# Altium schematic sheet Main.SchDoc
size A2 portrait
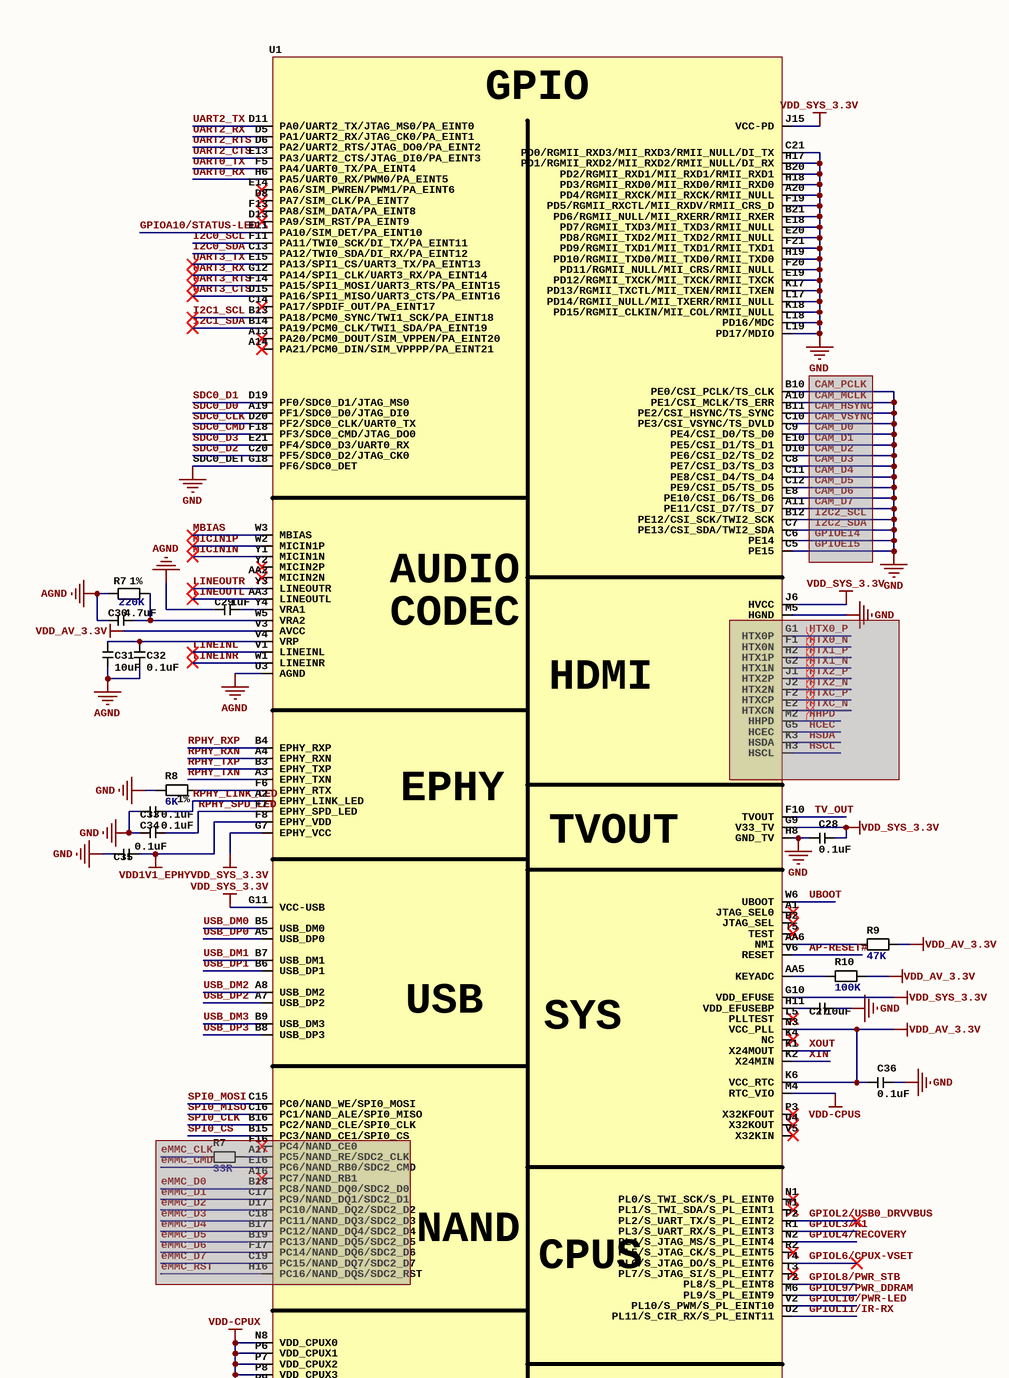
[diagram p0: Main.SchDoc, top left]
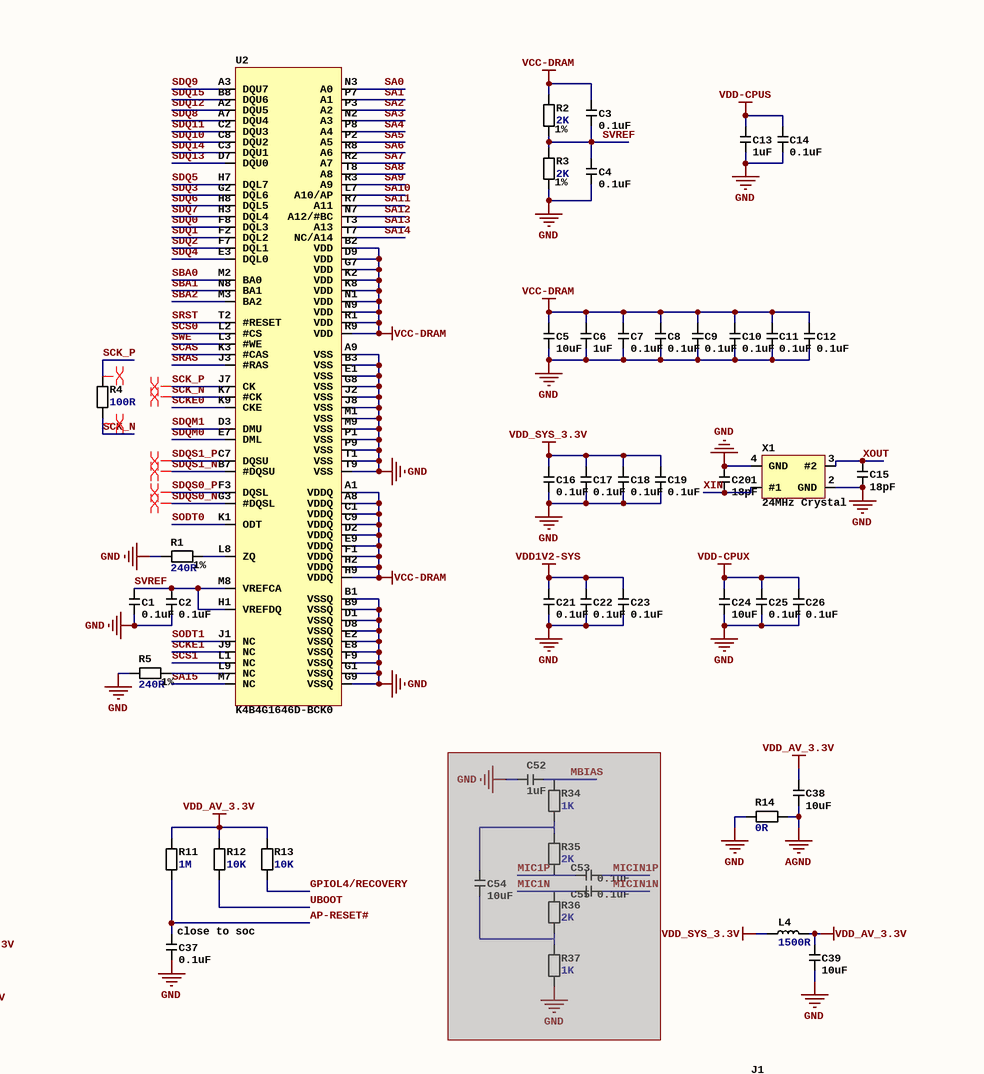
[diagram p1: Main.SchDoc, top right]
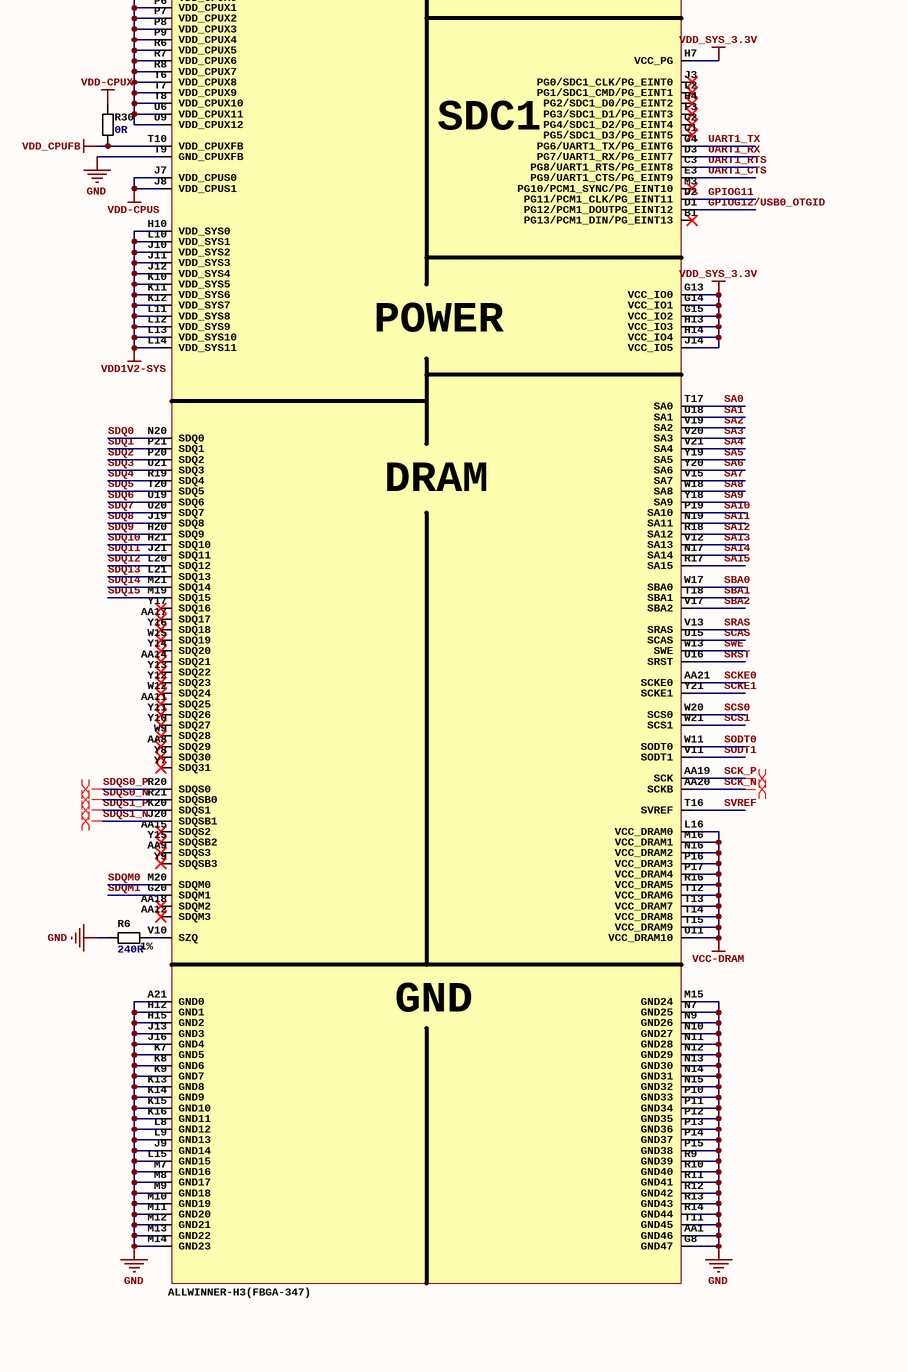
[diagram p2: Main.SchDoc, bottom left]
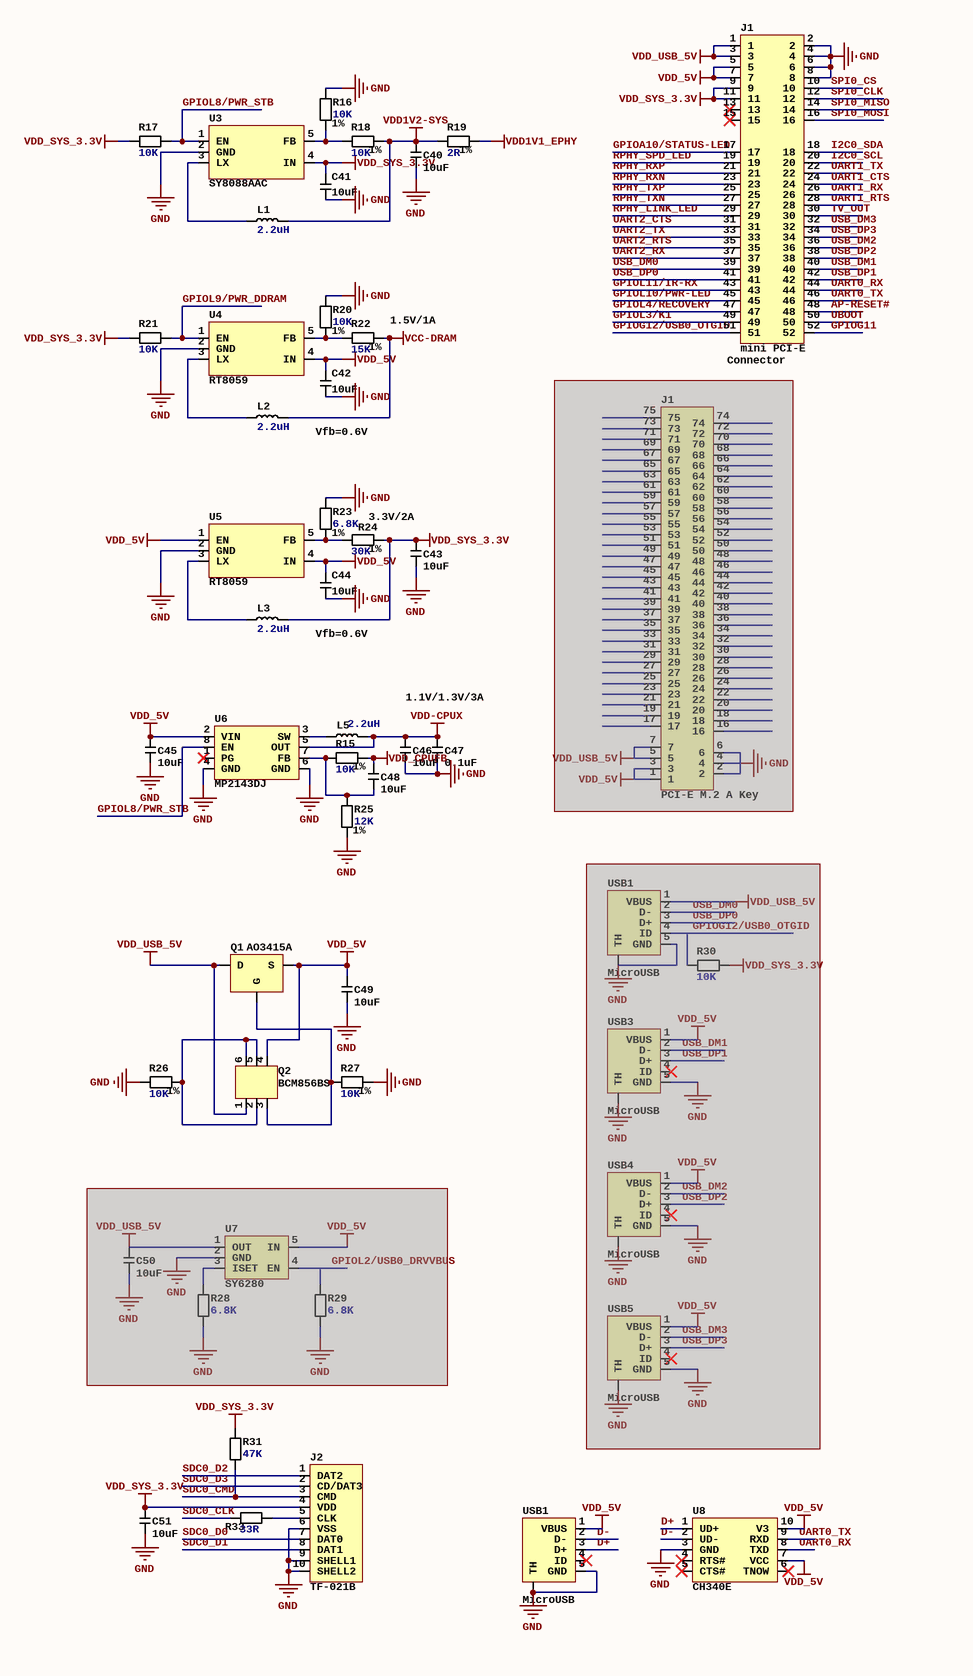
[diagram p3: Main.SchDoc, bottom right]

## Parts
(Parts that share a designator on the sheet are numbered #1, #2 ... from top to bottom, then left to right.)
C1  0.1uF  [CAP_0402]
C2  0.1uF  [CAP_0402]
C3  0.1uF  [CAP_0402]
C4  0.1uF  [CAP_0402]
C5  10uF  [CAP_0402]
C6  1uF  [CAP_0402]
C7  0.1uF  [CAP_0402]
C8  0.1uF  [CAP_0402]
C9  0.1uF  [CAP_0402]
C10  0.1uF  [CAP_0402]
C11  0.1uF  [CAP_0402]
C12  0.1uF  [CAP_0402]
C13  1uF  [CAP_0402]
C14  0.1uF  [CAP_0402]
C15  18pF  [CAP_0402]
C16  0.1uF  [CAP_0402]
C17  0.1uF  [CAP_0402]
C18  0.1uF  [CAP_0402]
C19  0.1uF  [CAP_0402]
C20  18pF  [CAP_0402]
C21  0.1uF  [CAP_0402]
C22  0.1uF  [CAP_0402]
C23  0.1uF  [CAP_0402]
C24  10uF  [CAP_0402]
C25  0.1uF  [CAP_0402]
C26  0.1uF  [CAP_0402]
C27  10uF  [CAP_0402]
C28  0.1uF  [CAP_0402]
C29  1uF  [CAP_0402]
C30  4.7uF  [CAP_0402]
C31  10uF  [CAP_0402]
C32  0.1uF  [CAP_0402]
C33  0.1uF  [CAP_0402]
C34  0.1uF  [CAP_0402]
C35  0.1uF  [CAP_0402]
C36  0.1uF  [CAP_0402]
C37  0.1uF  [CAP_0402]
C38  10uF  [CAP_0402]
C39  10uF  [CAP_0402]
C40  10uF  [CAP_0402]
C41  10uF  [CAP_0402]
C42  10uF  [CAP_0402]
C43  10uF  [CAP_0402]
C44  10uF  [CAP_0402]
C45  10uF  [CAP_0402]
C46  10uF  [CAP_0402]
C47  0.1uF  [CAP_0402]
C48  10uF  [CAP_0402]
C49  10uF  [CAP_0402]
C50  10uF  [CAP_0402]  (masked out: inside a compile mask, not in the netlist)
C51  10uF  [CAP_0402]
C52  1uF  [CAP_0402]  (masked out: inside a compile mask, not in the netlist)
C53  0.1uF  [CAP_0402]  (masked out: inside a compile mask, not in the netlist)
C54  10uF  [CAP_0402]  (masked out: inside a compile mask, not in the netlist)
C55  0.1uF  [CAP_0402]  (masked out: inside a compile mask, not in the netlist)
J1#1  mini PCI-E  System: Connector  [mini PCI-E]
J1#2  PCI-E M.2 A Key  [PCI-E M.2 A Key]  (masked out: inside a compile mask, not in the netlist)
J2  TF-021B  [TF-021B]
L1  2.2uH  [IND_2520]
L2  2.2uH  [IND_2520]
L3  2.2uH  [IND_2520]
L4  1500R  [IND_0402]
L5  2.2uH  [IND_2520]
Q1  AO3415A  [AO3415A]
Q2  BCM856BS  [BCM856BS]
R1  240R  [RES_0402]
R2  2K  [RES_0402]
R3  2K  [RES_0402]
R4  100R  [RES_0402]
R5  240R  [RES_0402]
R6  240R  [RES_0402]
R7#1  220K  [RES_0402]
R7#2  33R  [RES_0402]  (masked out: inside a compile mask, not in the netlist)
R8  6K  [RES_0402]
R9  47K  [RES_0402]
R10  100K  [RES_0402]
R11  1M  [RES_0402]
R12  10K  [RES_0402]
R13  10K  [RES_0402]
R14  0R  [RES_0402]
R15  10K  [RES_0402]
R16  10K  [RES_0402]
R17  10K  [RES_0402]
R18  10K  [RES_0402]
R19  2R  [RES_0402]
R20  10K  [RES_0402]
R21  10K  [RES_0402]
R22  15K  [RES_0402]
R23  6.8K  [RES_0402]
R24  30K  [RES_0402]
R25  12K  [RES_0402]
R26  10K  [RES_0402]
R27  10K  [RES_0402]
R28  6.8K  [RES_0402]  (masked out: inside a compile mask, not in the netlist)
R29  6.8K  [RES_0402]  (masked out: inside a compile mask, not in the netlist)
R30#1  0R  [RES_0402]
R30#2  10K  [RES_0402]  (masked out: inside a compile mask, not in the netlist)
R31  47K  [RES_0402]
R33  33R  [RES_0402]
R34  1K  [RES_0402]  (masked out: inside a compile mask, not in the netlist)
R35  2K  [RES_0402]  (masked out: inside a compile mask, not in the netlist)
R36  2K  [RES_0402]  (masked out: inside a compile mask, not in the netlist)
R37  1K  [RES_0402]  (masked out: inside a compile mask, not in the netlist)
U1  ALLWINNER-H3(FBGA-347)  [ALLWINNER-H3]
U2  K4B4G1646D-BCK0  [K4B4G1646D-BCK0]
U3  SY8088AAC  [SY8088AAC]
U4  RT8059  [RT8059]
U5  RT8059  [RT8059]
U6  MP2143DJ  [MP2143DJ]
U7  SY6280  [SY6280]  (masked out: inside a compile mask, not in the netlist)
U8  CH340E  [CH340E]
USB1#1  MicroUSB  [MicroUSB]  (masked out: inside a compile mask, not in the netlist)
USB1#2  MicroUSB  [MicroUSB]
USB3  MicroUSB  [MicroUSB]  (masked out: inside a compile mask, not in the netlist)
USB4  MicroUSB  [MicroUSB]  (masked out: inside a compile mask, not in the netlist)
USB5  MicroUSB  [MicroUSB]  (masked out: inside a compile mask, not in the netlist)
X1  24MHz Crystal  [SMD2520]

## Nets
AGND: C29.1 C30.1 C31.1 C32.1 C38.1 R7#1.2 R14.2 U1.U3(AGND)
GND: C1.1 C2.1 C4.1 C5.1 C6.1 C7.1 C8.1 C9.1 C10.1 C11.1 C12.1 C13.1 C14.1 C15.1 C16.1 C17.1 C18.1 C19.1 C20.2 C21.1 C22.1 C23.1 C24.1 C25.1 C26.1 C27.2 C28.1 C33.1 C34.1 C35.1 C36.2 C37.1 C39.1 C40.1 C41.1 C42.1 C43.1 C44.1 C45.1 C46.1 C47.1 C49.1 C51.1 J1#1.2 J1#1.4 J1#1.6 J1#1.8 J2.6(VSS) J2.9(SHELL1) J2.10(SHELL2) R1.1 R3.1 R5.1 R6.1 R8.1 R14.1 R16.2 R20.2 R23.2 R25.1 R26.1 R27.2 U1.A10(PE1/CSI_MCLK/TS_ERR) U1.A11(PE11/CSI_D7/TS_D7) U1.A20(PD4/RGMII_RXCK/MII_RXCK/RMII_NULL) U1.A21(GND0) U1.AA1(GND46) U1.B10(PE0/CSI_PCLK/TS_CLK) U1.B11(PE2/CSI_HSYNC/TS_SYNC) U1.B12(PE12/CSI_SCK/TWI2_SCK) U1.B20(PD2/RGMII_RXD1/MII_RXD1/RMII_RXD1) U1.B21(PD6/RGMII_NULL/MII_RXERR/RMII_RXER) U1.C5(PE15) U1.C6(PE14) U1.C7(PE13/CSI_SDA/TWI2_SDA) U1.C8(PE7/CSI_D3/TS_D3) U1.C9(PE4/CSI_D0/TS_D0) U1.C10(PE3/CSI_VSYNC/TS_DVLD) U1.C11(PE8/CSI_D4/TS_D4) U1.C12(PE9/CSI_D5/TS_D5) U1.C21(PD0/RGMII_RXD3/MII_RXD3/RMII_NULL/DI_TX) U1.D10(PE6/CSI_D2/TS_D2) U1.E8(PE10/CSI_D6/TS_D6) U1.E10(PE5/CSI_D1/TS_D1) U1.E18(PD7/RGMII_TXD3/MII_TXD3/RMII_NULL) U1.E19(PD12/RGMII_TXCK/MII_TXCK/RMII_TXCK) U1.E20(PD8/RGMII_TXD2/MII_TXD2/RMII_NULL) U1.F19(PD5/RGMII_RXCTL/MII_RXDV/RMII_CRS_D) U1.F20(PD11/RGMII_NULL/MII_CRS/RMII_NULL) U1.F21(PD9/RGMII_TXD1/MII_TXD1/RMII_TXD1) U1.G8(GND47) U1.G18(PF6/SDC0_DET) U1.H8(GND_TV) U1.H12(GND1) U1.H15(GND2) U1.H17(PD1/RGMII_RXD2/MII_RXD2/RMII_NULL/DI_RX) U1.H18(PD3/RGMII_RXD0/MII_RXD0/RMII_RXD0) U1.H19(PD10/RGMII_TXD0/MII_TXD0/RMII_TXD0) U1.J9(GND14) U1.J13(GND3) U1.J16(GND4) U1.K7(GND5) U1.K8(GND6) U1.K9(GND7) U1.K13(GND8) U1.K14(GND9) U1.K15(GND10) U1.K16(GND11) U1.K17(PD13/RGMII_TXCTL/MII_TXEN/RMII_TXEN) U1.K18(PD15/RGMII_CLKIN/MII_COL/RMII_NULL) U1.L8(GND12) U1.L9(GND13) U1.L15(GND15) U1.L17(PD14/RGMII_NULL/MII_TXERR/RMII_NULL) U1.L18(PD16/MDC) U1.L19(PD17/MDIO) U1.M5(HGND) U1.M7(GND16) U1.M8(GND17) U1.M9(GND18) U1.M10(GND19) U1.M11(GND20) U1.M12(GND21) U1.M13(GND22) U1.M14(GND23) U1.M15(GND24) U1.N7(GND25) U1.N9(GND26) U1.N10(GND27) U1.N11(GND28) U1.N12(GND29) U1.N13(GND30) U1.N14(GND31) U1.N15(GND32) U1.P10(GND33) U1.P11(GND34) U1.P12(GND35) U1.P13(GND36) U1.P14(GND37) U1.P15(GND38) U1.R9(GND39) U1.R10(GND40) U1.R11(GND41) U1.R12(GND42) U1.R13(GND43) U1.R14(GND44) U1.T9(GND_CPUXFB) U1.T11(GND45) U2.A9(VSS) U2.B1(VSSQ) U2.B3(VSS) U2.B9(VSSQ) U2.D1(VSSQ) U2.D8(VSSQ) U2.E1(VSS) U2.E2(VSSQ) U2.E8(VSSQ) U2.F9(VSSQ) U2.G1(VSSQ) U2.G8(VSS) U2.G9(VSSQ) U2.J2(VSS) U2.J8(VSS) U2.M1(VSS) U2.M9(VSS) U2.P1(VSS) U2.P9(VSS) U2.T1(VSS) U2.T9(VSS) U3.2(GND) U4.2(GND) U5.2(GND) U6.4(GND) U6.6(GND) U8.3(GND) USB1#2.0(TH) USB1#2.5(GND) X1.2(GND) X1.4(GND)
VCC-DRAM: C3.2 C5.2 C6.2 C7.2 C8.2 C9.2 C10.2 C11.2 C12.2 L2.2 R2.2 R22.2 U1.L16(VCC_DRAM0) U1.M16(VCC_DRAM1) U1.N16(VCC_DRAM2) U1.P16(VCC_DRAM3) U1.P17(VCC_DRAM4) U1.R16(VCC_DRAM5) U1.T12(VCC_DRAM6) U1.T13(VCC_DRAM7) U1.T14(VCC_DRAM8) U1.T15(VCC_DRAM9) U1.U11(VCC_DRAM10) U2.A1(VDDQ) U2.A8(VDDQ) U2.B2(VDD) U2.C1(VDDQ) U2.C9(VDDQ) U2.D2(VDDQ) U2.D9(VDD) U2.E9(VDDQ) U2.F1(VDDQ) U2.G7(VDD) U2.H2(VDDQ) U2.H9(VDDQ) U2.K2(VDD) U2.K8(VDD) U2.N1(VDD) U2.N9(VDD) U2.R1(VDD) U2.R9(VDD)
VDD1V1_EPHY: C35.2 R19.2 U1.F8(EPHY_VDD)
VDD1V2-SYS: C21.2 C22.2 C23.2 C40.2 L1.2 R18.2 R19.1 U1.H10(VDD_SYS0) U1.J10(VDD_SYS2) U1.J11(VDD_SYS3) U1.J12(VDD_SYS4) U1.K10(VDD_SYS5) U1.K11(VDD_SYS6) U1.K12(VDD_SYS7) U1.L10(VDD_SYS1) U1.L11(VDD_SYS8) U1.L12(VDD_SYS9) U1.L13(VDD_SYS10) U1.L14(VDD_SYS11)
VDD-CPUS: C13.2 C14.2 U1.J7(VDD_CPUS0) U1.J8(VDD_CPUS1) U1.M4(RTC_VIO)
VDD-CPUX: C24.2 C25.2 C26.2 C46.2 C47.2 L5.2 R30#1.2 U1.N8(VDD_CPUX0) U1.P6(VDD_CPUX1) U1.P7(VDD_CPUX2) U1.P8(VDD_CPUX3) U1.P9(VDD_CPUX4) U1.R6(VDD_CPUX5) U1.R7(VDD_CPUX6) U1.R8(VDD_CPUX7) U1.T6(VDD_CPUX8) U1.T7(VDD_CPUX9) U1.T8(VDD_CPUX10) U1.U6(VDD_CPUX11) U1.U9(VDD_CPUX12) U6.5(OUT)
VDD_5V: C42.2 C44.2 C45.2 C49.2 J1#1.5 J1#1.7 Q1.2(S) Q2.4 U4.4(IN) U5.1(EN) U5.4(IN) U6.2(VIN) U8.7(VCC) U8.10(V3) USB1#2.1(VBUS)
VDD_AV_3.3V: C36.1 C38.2 C39.2 L4.2 R9.2 R10.2 R11.2 R12.2 R13.2 U1.K6(VCC_RTC) U1.N3(VCC_PLL) U1.V3(AVCC)
VDD_CPUFB: C48.2 R15.2 R30#1.1 U1.T10(VDD_CPUXFB)
VDD_SYS_3.3V: C16.2 C17.2 C18.2 C19.2 C28.2 C41.2 C43.2 C51.2 J1#1.9 J1#1.11 J2.4(VDD) L3.2 L4.1 R17.1 R21.1 R24.2 R31.2 U1.G7(EPHY_VCC) U1.G9(V33_TV) U1.G10(VDD_EFUSE) U1.G11(VCC-USB) U1.G13(VCC_IO0) U1.G14(VCC_IO1) U1.G15(VCC_IO2) U1.H7(VCC_PG) U1.H13(VCC_IO3) U1.H14(VCC_IO4) U1.J6(HVCC) U1.J14(VCC_IO5) U1.J15(VCC-PD) U3.4(IN)
VDD_USB_5V: J1#1.1 J1#1.3 Q1.3(D) Q2.1
AP-RESET#: C37.2 J1#1.48 R11.1 U1.V6(RESET)
D+: U8.1(UD+) USB1#2.3(D+)
D-: U8.2(UD-) USB1#2.2(D-)
GPIOA10/STATUS-LED: J1#1.17 U1.E11(PA10/SIM_DET/PA_EINT10)
GPIOG11: J1#1.52 U1.D2(PG11/PCM1_CLK/PG_EINT11)
GPIOG12/USB0_OTGID: J1#1.51 U1.D1(PG12/PCM1_DOUTPG_EINT12)
GPIOL2/USB0_DRVVBUS: U1.P2(PL2/S_UART_TX/S_PL_EINT2)
GPIOL3/K1: J1#1.49 U1.R1(PL3/S_UART_RX/S_PL_EINT3)
GPIOL4/RECOVERY: J1#1.47 R13.1 U1.N2(PL4/S_JTAG_MS/S_PL_EINT4)
GPIOL6/CPUX-VSET: U1.T4(PL6/S_JTAG_DO/S_PL_EINT6)
GPIOL8/PWR_STB: R17.2 U1.T2(PL8/S_PL_EINT8) U3.1(EN) U6.8(EN)
GPIOL9/PWR_DDRAM: R21.2 U1.M6(PL9/S_PL_EINT9) U4.1(EN)
GPIOL10/PWR-LED: J1#1.45 U1.V2(PL10/S_PWM/S_PL_EINT10)
GPIOL11/IR-RX: J1#1.43 U1.U2(PL11/S_CIR_RX/S_PL_EINT11)
I2C0_SCL: J1#1.20 U1.F11(PA11/TWI0_SCK/DI_TX/PA_EINT11)
I2C0_SDA: J1#1.18 U1.C13(PA12/TWI0_SDA/DI_RX/PA_EINT12)
I2C1_SCL: U1.B13(PA18/PCM0_SYNC/TWI1_SCK/PA_EINT18)
I2C1_SDA: U1.B14(PA19/PCM0_CLK/TWI1_SDA/PA_EINT19)
LINEINL: U1.V1(LINEINL)
LINEINR: U1.W1(LINEINR)
LINEOUTL: U1.AA3(LINEOUTL)
LINEOUTR: U1.Y3(LINEOUTR)
MBIAS: U1.W3(MBIAS)
MICIN1N: U1.Y1(MICIN1N)
MICIN1P: U1.W2(MICIN1P)
RPHY_LINK_LED: C33.2 J1#1.29 U1.A2(EPHY_LINK_LED)
RPHY_RXN: J1#1.23 U1.A4(EPHY_RXN)
RPHY_RXP: J1#1.21 U1.B4(EPHY_RXP)
RPHY_SPD_LED: C34.2 J1#1.19 U1.F7(EPHY_SPD_LED)
RPHY_TXN: J1#1.27 U1.A3(EPHY_TXN)
RPHY_TXP: J1#1.25 U1.B3(EPHY_TXP)
SA0: U1.T17(SA0) U2.N3(A0)
SA1: U1.U18(SA1) U2.P7(A1)
SA2: U1.V19(SA2) U2.P3(A2)
SA3: U1.V20(SA3) U2.N2(A3)
SA4: U1.V21(SA4) U2.P8(A4)
SA5: U1.Y19(SA5) U2.P2(A5)
SA6: U1.Y20(SA6) U2.R8(A6)
SA7: U1.V15(SA7) U2.R2(A7)
SA8: U1.W18(SA8) U2.T8(A8)
SA9: U1.Y18(SA9) U2.R3(A9)
SA10: U1.P19(SA10) U2.L7(A10/AP)
SA11: U1.N19(SA11) U2.R7(A11)
SA12: U1.R18(SA12) U2.N7(A12/#BC)
SA13: U1.V12(SA13) U2.T3(A13)
SA14: U1.N17(SA14) U2.T7(NC/A14)
SA15: U1.R17(SA15) U2.M7(NC)
SBA0: U1.W17(SBA0) U2.M2(BA0)
SBA1: U1.T18(SBA1) U2.N8(BA1)
SBA2: U1.V17(SBA2) U2.M3(BA2)
SCAS: U1.U15(SCAS) U2.K3(#CAS)
SCK_N: R4.1 U1.AA20(SCKB) U2.K7(#CK)
SCK_P: R4.2 U1.AA19(SCK) U2.J7(CK)
SCKE0: U1.AA21(SCKE0) U2.K9(CKE)
SCKE1: U1.Y21(SCKE1) U2.J9(NC)
SCS0: U1.W20(SCS0) U2.L2(#CS)
SCS1: U1.W21(SCS1) U2.L1(NC)
SDC0_CLK: R33.1 U1.D20(PF2/SDC0_CLK/UART0_TX)
SDC0_CMD: J2.3(CMD) R31.1 U1.F18(PF3/SDC0_CMD/JTAG_DO0)
SDC0_D0: J2.7(DAT0) U1.A19(PF1/SDC0_D0/JTAG_DI0)
SDC0_D1: J2.8(DAT1) U1.D19(PF0/SDC0_D1/JTAG_MS0)
SDC0_D2: J2.1(DAT2) U1.C20(PF5/SDC0_D2/JTAG_CK0)
SDC0_D3: J2.2(CD/DAT3) U1.E21(PF4/SDC0_D3/UART0_RX)
SDQ0: U1.N20(SDQ0) U2.F8(DQL3)
SDQ1: U1.P21(SDQ1) U2.F2(DQL2)
SDQ2: U1.P20(SDQ2) U2.F7(DQL1)
SDQ3: U1.U21(SDQ3) U2.G2(DQL6)
SDQ4: U1.R19(SDQ4) U2.E3(DQL0)
SDQ5: U1.T20(SDQ5) U2.H7(DQL7)
SDQ6: U1.U19(SDQ6) U2.H8(DQL5)
SDQ7: U1.U20(SDQ7) U2.H3(DQL4)
SDQ8: U1.J19(SDQ8) U2.A7(DQU4)
SDQ9: U1.H20(SDQ9) U2.A3(DQU7)
SDQ10: U1.H21(SDQ10) U2.C8(DQU2)
SDQ11: U1.J21(SDQ11) U2.C2(DQU3)
SDQ12: U1.L20(SDQ12) U2.A2(DQU5)
SDQ13: U1.L21(SDQ13) U2.D7(DQU0)
SDQ14: U1.M21(SDQ14) U2.C3(DQU1)
SDQ15: U1.M19(SDQ15) U2.B8(DQU6)
SDQM0: U1.M20(SDQM0) U2.E7(DML)
SDQM1: U1.G20(SDQM1) U2.D3(DMU)
SDQS0_N: U1.R21(SDQSB0) U2.G3(#DQSL)
SDQS0_P: U1.R20(SDQS0) U2.F3(DQSL)
SDQS1_N: U1.J20(SDQSB1) U2.B7(#DQSU)
SDQS1_P: U1.K20(SDQS1) U2.C7(DQSU)
SODT0: U1.W11(SODT0) U2.K1(ODT)
SODT1: U1.V11(SODT1) U2.J1(NC)
SPI0_CLK: J1#1.12 U1.B16(PC2/NAND_CLE/SPI0_CLK)
SPI0_CS: J1#1.10 U1.B15(PC3/NAND_CE1/SPI0_CS)
SPI0_MISO: J1#1.14 U1.C16(PC1/NAND_ALE/SPI0_MISO)
SPI0_MOSI: J1#1.16 U1.C15(PC0/NAND_WE/SPI0_MOSI)
SRAS: U1.V13(SRAS) U2.J3(#RAS)
SRST: U1.U16(SRST) U2.T2(#RESET)
SVREF: C1.2 C2.2 C3.1 C4.2 R2.1 R3.2 U1.T16(SVREF) U2.H1(VREFDQ) U2.M8(VREFCA)
SWE: U1.W13(SWE) U2.L3(#WE)
TV_OUT: J1#1.30 U1.F10(TVOUT)
UART0_RX: J1#1.44 U1.H6(PA5/UART0_RX/PWM0/PA_EINT5) U8.8(TXD)
UART0_TX: J1#1.46 U1.F5(PA4/UART0_TX/PA_EINT4) U8.9(RXD)
UART1_CTS: J1#1.24 U1.E3(PG9/UART1_CTS/PG_EINT9)
UART1_RTS: J1#1.28 U1.C3(PG8/UART1_RTS/PG_EINT8)
UART1_RX: J1#1.26 U1.D3(PG7/UART1_RX/PG_EINT7)
UART1_TX: J1#1.22 U1.G4(PG6/UART1_TX/PG_EINT6)
UART2_CTS: J1#1.31 U1.E13(PA3/UART2_CTS/JTAG_DI0/PA_EINT3)
UART2_RTS: J1#1.35 U1.D6(PA2/UART2_RTS/JTAG_DO0/PA_EINT2)
UART2_RX: J1#1.37 U1.D5(PA1/UART2_RX/JTAG_CK0/PA_EINT1)
UART2_TX: J1#1.33 U1.D11(PA0/UART2_TX/JTAG_MS0/PA_EINT0)
UART3_CTS: U1.D15(PA16/SPI1_MISO/UART3_CTS/PA_EINT16)
UART3_RTS: U1.F14(PA15/SPI1_MOSI/UART3_RTS/PA_EINT15)
UART3_RX: U1.G12(PA14/SPI1_CLK/UART3_RX/PA_EINT14)
UART3_TX: U1.E15(PA13/SPI1_CS/UART3_TX/PA_EINT13)
UBOOT: J1#1.50 R12.1 U1.W6(UBOOT)
USB_DM0: J1#1.39 U1.B5(USB_DM0)
USB_DM1: J1#1.40 U1.B7(USB_DM1)
USB_DM2: J1#1.36 U1.A8(USB_DM2)
USB_DM3: J1#1.32 U1.B9(USB_DM3)
USB_DP0: J1#1.41 U1.A5(USB_DP0)
USB_DP1: J1#1.42 U1.B6(USB_DP1)
USB_DP2: J1#1.38 U1.A7(USB_DP2)
USB_DP3: J1#1.34 U1.B8(USB_DP3)
XIN: C20.1 U1.K2(X24MIN) X1.1(#1)
XOUT: C15.2 U1.K1(X24MOUT) X1.3(#2)
NetC27_1: C27.1 U1.H11(VDD_EFUSEBP)
NetC29_2: C29.2 U1.Y4(VRA1)
NetC30_2: C30.2 R7#1.1 U1.W5(VRA2)
NetC31_2: C31.2 C32.2 U1.V4(VRP)
NetC48_1: C48.1 R15.1 R25.2 U6.7(FB)
NetJ2_5: J2.5(CLK) R33.2
NetL1_1: L1.1 U3.3(LX)
NetL2_1: L2.1 U4.3(LX)
NetL3_1: L3.1 U5.3(LX)
NetL5_1: L5.1 U6.3(SW)
NetQ1_1: Q1.1(G) Q2.3 R27.1
NetQ2_2: Q2.2 Q2.5 Q2.6 R26.2
NetR1_2: R1.2 U2.L8(ZQ)
NetR5_2: R5.2 U2.L9(NC)
NetR6_2: R6.2 U1.V10(SZQ)
NetR8_2: R8.2 U1.F6(EPHY_RTX)
NetR9_1: R9.1 U1.AA6(NMI)
NetR10_1: R10.1 U1.AA5(KEYADC)
NetR16_1: R16.1 R18.1 U3.5(FB)
NetR20_1: R20.1 R22.1 U4.5(FB)
NetR23_1: R23.1 R24.1 U5.5(FB)

Not connected (* = marked no-connect by the designer): J1#1 13* 15*; U1 A1(JTAG_SEL0)* A13(PA20/PCM0_DOUT/SIM_VPPEN/PA_EINT20)* A14(PA21/PCM0_DIN/SIM_VPPPP/PA_EINT21)* A16(PC7/NAND_RB1)* A17(PC5/NAND_RE/SDC2_CLK) AA2(MICIN2N)* AA8(SDQ29)* AA9(SDQS3)* AA11(SDQ25)* AA12(SDQM3)* AA14(SDQ21)* AA15(SDQS2)* AA17(SDQ17)* AA18(SDQM2)* B1(PG13/PCM1_DIN/PG_EINT13)* B2(JTAG_SEL)* B17(PC12/NAND_DQ4/SDC2_D4) B18(PC8/NAND_DQ0/SDC2_D0) B19(PC13/NAND_DQ5/SDC2_D5) C1(PG5/SDC1_D3/PG_EINT5)* C2(PG4/SDC1_D2/PG_EINT4)* C14(PA17/SPDIF_OUT/PA_EINT17)* C17(PC9/NAND_DQ1/SDC2_D1) C18(PC11/NAND_DQ3/SDC2_D3) C19(PC15/NAND_DQ7/SDC2_D7) D8(PA7/SIM_CLK/PA_EINT7)* D13(PA9/SIM_RST/PA_EINT9)* D17(PC10/NAND_DQ2/SDC2_D2) E2(HTXCN) E14(PA6/SIM_PWREN/PWM1/PA_EINT6)* E16(PC6/NAND_RB0/SDC2_CMD) F1(HTX0N) F2(HTXCP) F3(PG3/SDC1_D1/PG_EINT3)* F13(PA8/SIM_DATA/PA_EINT8)* F16(PC4/NAND_CE0)* F17(PC14/NAND_DQ6/SDC2_D6) G1(HTX0P) G2(HTX1N) G5(HCEC) H2(HTX1P) H3(HSCL) H4(PG2/SDC1_D0/PG_EINT2)* H16(PC16/NAND_DQS/SDC2_RST) J1(HTX2P) J2(HTX2N) J3(PG0/SDC1_CLK/PG_EINT0)* K3(HSDA) K4(NC)* L2(PG1/SDC1_CMD/PG_EINT1)* L5(PLLTEST)* M1(PL1/S_TWI_SDA/S_PL_EINT1)* M2(HHPD) M3(PG10/PCM1_SYNC/PG_EINT10)* N1(PL0/S_TWI_SCK/S_PL_EINT0)* P3(X32KFOUT)* R2(PL5/S_JTAG_CK/S_PL_EINT5)* T3(PL7/S_JTAG_SI/S_PL_EINT7)* T5(TEST)* U4(X32KOUT)* V5(X32KIN)* W9(SDQ28)* W12(SDQ24)* W15(SDQ19)* Y2(MICIN2P)* Y7(SDQ31)* Y8(SDQ30)* Y9(SDQSB3)* Y10(SDQ27)* Y11(SDQ26)* Y12(SDQ23)* Y13(SDQ22)* Y14(SDQ20)* Y15(SDQSB2)* Y16(SDQ18)* Y17(SDQ16)*; U6 1(PG)*; U8 4(RTS#)* 5(CTS#)* 6(TNOW)*; USB1#2 4(ID)*

## Layout directives
differential pair: NetU1_E2, NetU1_F1, NetU1_F2, NetU1_G1, NetU1_G2, NetU1_H2, NetU1_J1, NetU1_J2, SCK_N, SCK_P, SDQS0_N, SDQS0_P, SDQS1_N, SDQS1_P

## Notes on the sheet
- (near R2) 1%
- (near R3) 1%
- (near U1) SDC0_DET
- (near R1) 1%
- (near R7#1) 1%
- (near R5) 1%
- (near R8) 1%
- (near C37) close to soc
- (near R16) 1%
- (near R18) 1%
- (near R19) 1%
- 1%
- (near R22) 1.5V/1A
- (near R22) 1%
- Vfb=0.6V
- (near R24) 1%
- (near R24) 3.3V/2A
- 1.1V/1.3V/3A
- (near R15) 1%
- (near R25) 1%
- (near R26) 1%
- (near R27) 1%
- (near R6) 1%
- Title
- Size:
- Date:
- File:
- A2
- Number:
- Time:
- Revision:
- Sheet
- of
- (in symbol ALLWINNER-H3) GPIO; AUDIO; CODEC; HDMI; EPHY; USB; SYS; NAND; CPUS; SDC1; POWER; DRAM; GND

## Library data of the parts
C1-C4 C7-C12 C14 C16-C19 C21-C23 C25 C26 C28 C32-C37 C47 C53 C55 = CAP_0402_0.1uF: 0402
C5 C24 C27 C31 C38-C46 C48-C51 C54 = CAP_0402_10uF: 0402
C6 C13 C29 C52 = CAP_0402_1uF: 0402
C15 C20 = CAP_0402_18pF: 0402
C30 = CAP_0402_4.7uF: 0402
J2 = TF卡座-021B
L1-L3 L5 = IND_2520_2.2uH: 2520
L4 = IND_0402_1500R: 0402磁珠
Q1 = AO3415A: MOSFET
Q2 = BCM856BS: Transistor
R1 R5 R6 = RES_0402_240R: 0402
R2 R3 R35 R36 = RES_0402_2K: 0402
R4 = RES_0402_100R: 0402
R7#1 = RES_0402_220K: 0402
R7#2 R33 = RES_0402_33R: 0402
R8 = RES_0402_6K: 0402
R9 R31 = RES_0402_47K: 0402
R10 = RES_0402_100K: 0402
R11 = RES_0402_1M: 0402
R12 R13 R15-R18 R20 R21 R26 R27 R30#2 = RES_0402_10K: 0402
R14 R30#1 = RES_0402_0R: 0402
R19 = RES_0402_2R: 0402
R22 = RES_0402_15K: 0402
R23 R28 R29 = RES_0402_6.8K: 0402
R24 = RES_0402_30K: 0402
R25 = RES_0402_12K: 0402
R34 R37 = RES_0402_1K: 0402
U1 = ALLWINNER-H3
U2 = K4B4G1646D-BCK0: K4B4G1646D-BCK0(FBGA-96_256Mx16_DDR3-1600_11-11-11)
U3 = SY8088AAC: SOT23-5
U4 U5 = RT8059: SOT23-5
U6 = MP2143DJ: SOT23-8
U7 = SY6280: SOT23-5
U8 = CH340E: MSOP-10
X1 = 24MHz Crystal 2520: SMD2520